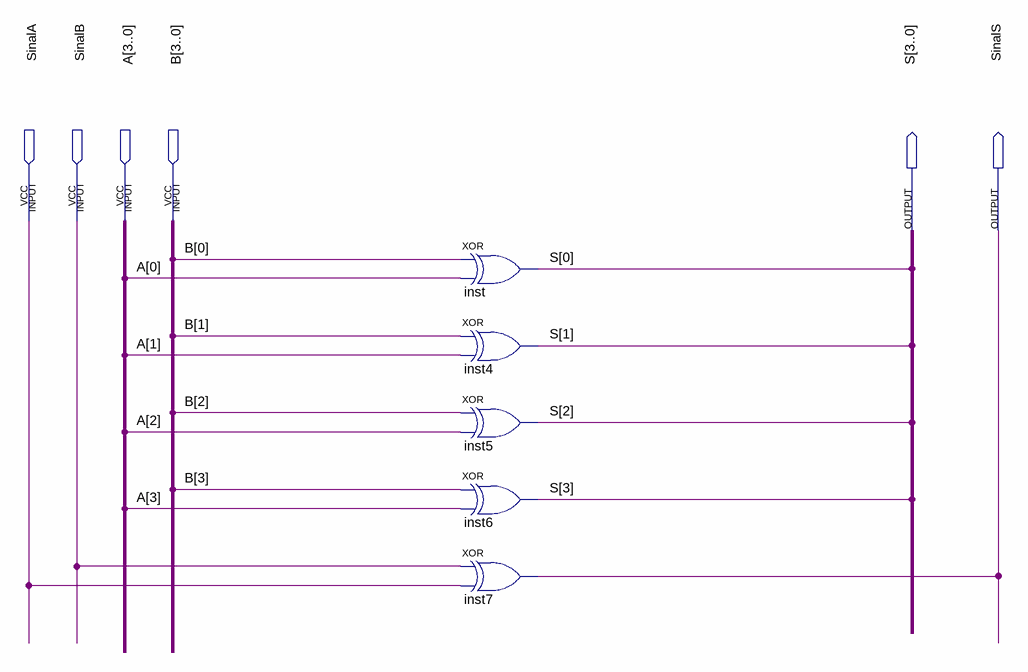
[diagram p0: schematic sheet]
// Quartus schematic axorb.bdf as structural Verilog: 5 symbols, 6 pins
module axorb (
  input  SinalA,
  input  SinalB,
  input  [3:0] A,
  input  [3:0] B,
  output [3:0] S,
  output SinalS
);

  xor inst (S[0], B[0], A[0]);
  xor inst4 (S[1], B[1], A[1]);
  xor inst5 (S[2], B[2], A[2]);
  xor inst6 (S[3], B[3], A[3]);
  xor inst7 (SinalS, SinalB, SinalA);
endmodule
